# EasyEDA schematic SCH_Loader.json
TITLE: Loader; REV: 1.0; Date: 2024-04-25; Sheet: 1/1; Drawn By: Linkort; Company: Your Company
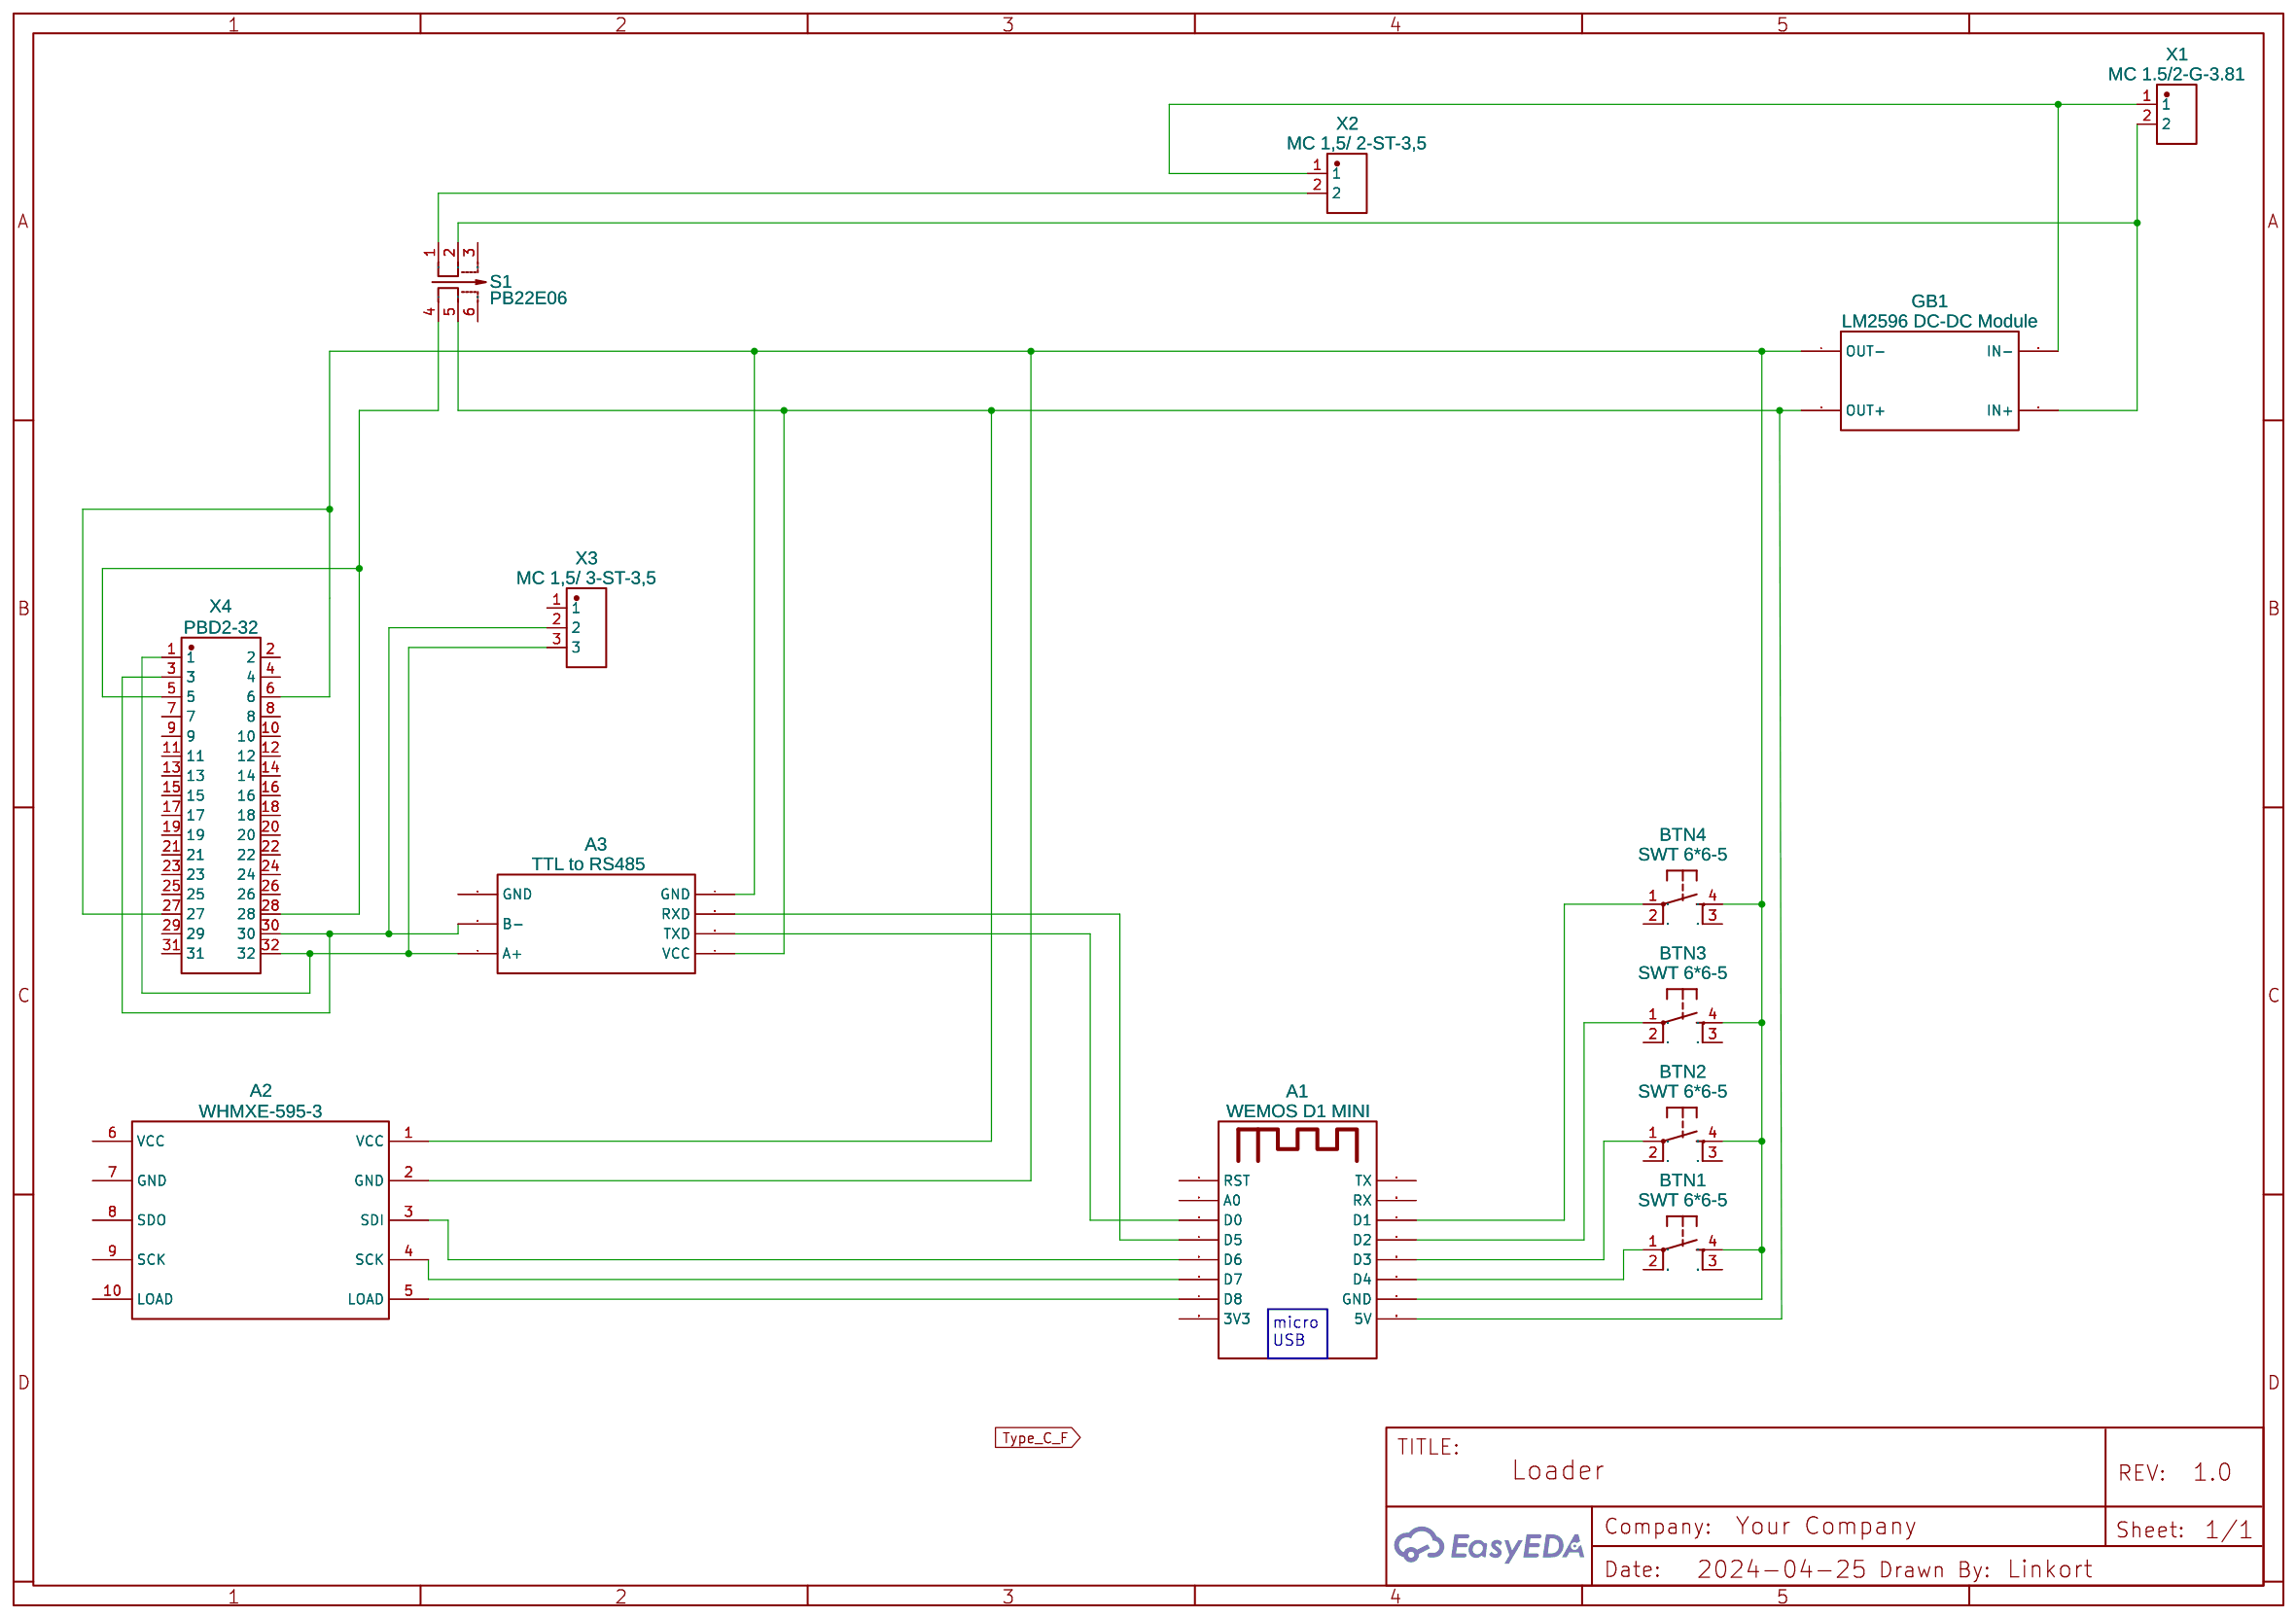
[diagram p0: schematic sheet]

## Parts
A1  WEMOS D1 MINI  [WEMOS_D1_MINI]
A2  WHMXE-595-3  [WHMXE-595-2]
A3  TTL to RS485  [HW-519-RS485]
BTN1  SWT 6*6-5  [TACTILE-BUTTON-SMD]
BTN2  SWT 6*6-5  [TACTILE-BUTTON-SMD]
BTN3  SWT 6*6-5  [TACTILE-BUTTON-SMD]
BTN4  SWT 6*6-5  [TACTILE-BUTTON-SMD]
GB1  LM2596 DC-DC Module  [LM2596-MODULE]
S1  PB22E06  [SW-TH_6P-L5.8-W5.8-P2.00-LS4.5_PB22E06371-0625]
X1  MC 1.5/2-G-3.81  [CONN-TH_1803277]
X2  MC 1,5/ 2-ST-3,5  [CONN-TH_2PIN2MM-1]
X3  MC 1,5/ 3-ST-3,5  [CONN-SMD_3PIN_POGO_2.54]
X4  PBD2-32  [HDR-TH_32P-P2.54-V-M-R2-C16-S2.54]

## Library data of the parts
A1 = WEMOS D1 MINI COPY: Manufacturer: Wemos; Manufacturer Part: D1 Mini; Supplier: AliExpress; Supplier Part: D1 Mini; link: https://www.wemos.cc/en/latest/d1/d1_mini.html; Contributor: JanneTe
A2 = WHMXE-595: link: https://item.taobao.com/item.htm?id=43447719493; Contributor: galogenkz; Package Display: No
A3 = HW-519-RS485: Contributor: vanemarvaldemar
BTN1-BTN4 = TACTILE_BUTTON_SMD: Contributor: calimero2312
GB1 = LM2596-MODULE COPY: Contributor: Rifat674
S1 = PB22E06071: Contributor: LCSC; Supplier: LCSC; Supplier Part: C194404; Manufacturer: GANGYUAN(港源); Manufacturer Part: PB22E06371-0625; JLCPCB Part Class: Extended Part
X1 = 1803277: Contributor: LCSC; Supplier: LCSC; Supplier Part: C480537; Manufacturer: Phoenix Contact(菲尼克斯); JLCPCB Part Class: Extended Part
X2 = 2PIN(2MM)-1: Contributor: LCSC; Supplier: LCSC; Supplier Part: C9900004826; Manufacturer: null; JLCPCB Part Class: Extended Part
X3 = 3PIN_POGO_2.54: Supplier: LCSC; Supplier Part: C9900091541; Manufacturer: null; JLCPCB Part Class: Extended Part; Contributor: lcsc
X4 = PZ254-2-16-Z-2.5-G1 COPY: Supplier: LCSC; Supplier Part: C18198011; Manufacturer: HCTL(华灿天禄); Manufacturer Part: PZ254-2-16-Z-2.5-G1; Contributor: lcsc

## Nets
Net-(A1-3): A1.3(D0) A3.5(TXD)
Net-(A1-4): A1.4(D5) A3.6(RXD)
Net-(A1-5): A1.5(D6) A2.3(SDI)
Net-(A1-6): A1.6(D7) A2.4(SCK)
Net-(A1-7): A1.7(D8) A2.5(LOAD)
Net-(A1-11): A1.11(D1) BTN4.1(SWA1)
Net-(A1-12): A1.12(D2) BTN3.1(SWA1)
Net-(A1-13): A1.13(D3) BTN2.1(SWA1)
Net-(A1-14): A1.14(D4) BTN1.1(SWA1)
Net-(A1-15): A1.15(GND) A2.2(GND) A3.7(GND) BTN1.4(SWA2) BTN2.4(SWA2) BTN3.4(SWA2) BTN4.4(SWA2) GB1.4(OUT-) X4.6 X4.27
Net-(A1-16): A1.16(5V) A2.1(VCC) A3.4(VCC) GB1.3(OUT+) S1.5
Net-(A3-1): A3.1(A+) X3.3 X4.1 X4.32
Net-(A3-2): A3.2(B-) X3.2 X4.3 X4.30
Net-(GB1-1): GB1.1(IN+) S1.2 X1.2
Net-(GB1-2): GB1.2(IN-) X1.1 X2.1
Net-(S1-1): S1.1 X2.2
Net-(S1-4): S1.4 X4.5 X4.28

Not connected (* = marked no-connect by the designer): A1 1(RST) 2(A0) 8(3V3) 9(TX) 10(RX); A2 6(VCC) 7(GND) 8(SDO) 9(SCK) 10(LOAD); A3 3(GND); BTN1 2(SWB1) 3(SWB2); BTN2 2(SWB1) 3(SWB2); BTN3 2(SWB1) 3(SWB2); BTN4 2(SWB1) 3(SWB2); S1 3 6; X3 1; X4 2 4 7 8 9 10 11 12 13 14 15 16 17 18 19 20 21 22 23 24 25 26 29 31

## Notes on the sheet
- micro
  USB
